# Altium schematic sheet ESIMA E-Meter_Radio.SchDoc: Esima Radio (zu CC2530EVM)
size A3; DrawnBy: Jürgen Merz; Address1: Wilhelm- Schickard- Strasse 10; Address2: 78052 Villingen Schwenningen; Address3: juergen.merz@hsg-imit.de; Address4: Tel. +49 7721 943 138; PhoneNumber: +49 7721 943 138; FaxNumber: +49 7721 943 140
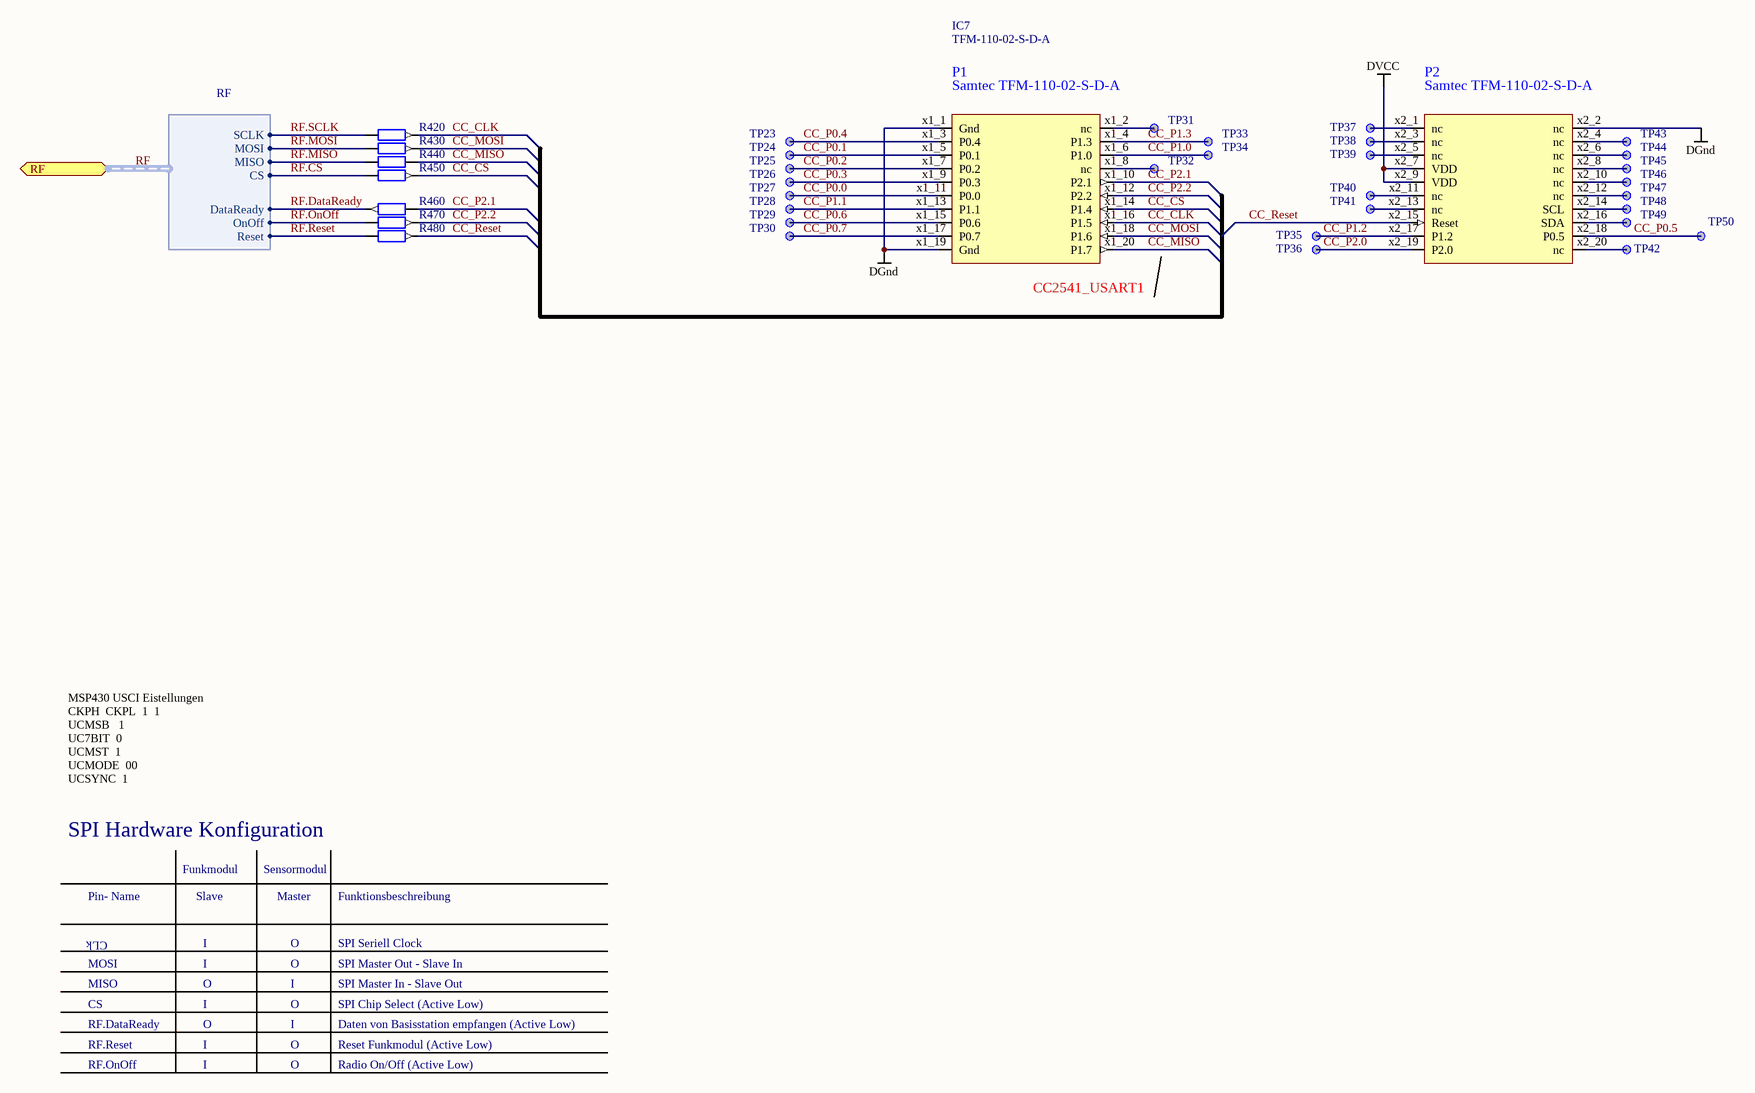
[diagram p0: ESIMA E-Meter_Radio.SchDoc]

## Parts
IC7  TFM-110-02-S-D-A  [CC2530EM-Board]
R42  0  [RESC1608N]
R43  0  [RESC1608N]
R44  0  [RESC1608N]
R45  0  [RESC1608N]
R46  0  [RESC1608N]
R47  0  [RESC1608N]
R48  0  [RESC1608N]
TP23  Testpoint 1mm  [Testpoint 1mm]  (value not drawn)  (no BOM)
TP24  Testpoint 1mm  [Testpoint 1mm]  (value not drawn)  (no BOM)
TP25  Testpoint 1mm  [Testpoint 1mm]  (value not drawn)  (no BOM)
TP26  Testpoint 1mm  [Testpoint 1mm]  (value not drawn)  (no BOM)
TP27  Testpoint 1mm  [Testpoint 1mm]  (value not drawn)  (no BOM)
TP28  Testpoint 1mm  [Testpoint 1mm]  (value not drawn)  (no BOM)
TP29  Testpoint 1mm  [Testpoint 1mm]  (value not drawn)  (no BOM)
TP30  Testpoint 1mm  [Testpoint 1mm]  (value not drawn)  (no BOM)
TP31  Testpoint 1mm  [Testpoint 1mm]  (value not drawn)  (no BOM)
TP32  Testpoint 1mm  [Testpoint 1mm]  (value not drawn)  (no BOM)
TP33  Testpoint 1mm  [Testpoint 1mm]  (value not drawn)  (no BOM)
TP34  Testpoint 1mm  [Testpoint 1mm]  (value not drawn)  (no BOM)
TP35  Testpoint 1mm  [Testpoint 1mm]  (value not drawn)  (no BOM)
TP36  Testpoint 1mm  [Testpoint 1mm]  (value not drawn)  (no BOM)
TP37  Testpoint 1mm  [Testpoint 1mm]  (value not drawn)  (no BOM)
TP38  Testpoint 1mm  [Testpoint 1mm]  (value not drawn)  (no BOM)
TP39  Testpoint 1mm  [Testpoint 1mm]  (value not drawn)  (no BOM)
TP40  Testpoint 1mm  [Testpoint 1mm]  (value not drawn)  (no BOM)
TP41  Testpoint 1mm  [Testpoint 1mm]  (value not drawn)  (no BOM)
TP42  Testpoint 1mm  [Testpoint 1mm]  (value not drawn)  (no BOM)
TP43  Testpoint 1mm  [Testpoint 1mm]  (value not drawn)  (no BOM)
TP44  Testpoint 1mm  [Testpoint 1mm]  (value not drawn)  (no BOM)
TP45  Testpoint 1mm  [Testpoint 1mm]  (value not drawn)  (no BOM)
TP46  Testpoint 1mm  [Testpoint 1mm]  (value not drawn)  (no BOM)
TP47  Testpoint 1mm  [Testpoint 1mm]  (value not drawn)  (no BOM)
TP48  Testpoint 1mm  [Testpoint 1mm]  (value not drawn)  (no BOM)
TP49  Testpoint 1mm  [Testpoint 1mm]  (value not drawn)  (no BOM)
TP50  Testpoint 1mm  [Testpoint 1mm]  (value not drawn)  (no BOM)

## Ports
RF (harness RF)

## Harnesses
RF: SCLK, MOSI, MISO, CS, DataReady, OnOff, Reset

## Nets
DGnd: IC7.x1_1(Gnd) IC7.x1_19(Gnd) IC7.x2_2(nc)
DVCC: IC7.x2_7(VDD) IC7.x2_9(VDD)
CC_CLK: IC7.x1_16(P1.5) R42.1
CC_CS: IC7.x1_14(P1.4) R45.1
CC_MISO: IC7.x1_20(P1.7) R44.1
CC_MOSI: IC7.x1_18(P1.6) R43.1
CC_P0.0: IC7.x1_11(P0.0) TP27.1
CC_P0.1: IC7.x1_5(P0.1) TP24.1
CC_P0.2: IC7.x1_7(P0.2) TP25.1
CC_P0.3: IC7.x1_9(P0.3) TP26.1
CC_P0.4: IC7.x1_3(P0.4) TP23.1
CC_P0.5: IC7.x2_18(P0.5) TP50.1
CC_P0.6: IC7.x1_15(P0.6) TP29.1
CC_P0.7: IC7.x1_17(P0.7) TP30.1
CC_P1.0: IC7.x1_6(P1.0) TP34.1
CC_P1.1: IC7.x1_13(P1.1) TP28.1
CC_P1.2: IC7.x2_17(P1.2) TP35.1
CC_P1.3: IC7.x1_4(P1.3) TP33.1
CC_P2.0: IC7.x2_19(P2.0) TP36.1
CC_P2.1: IC7.x1_10(P2.1) R46.1
CC_P2.2: IC7.x1_12(P2.2) R47.1
CC_Reset: IC7.x2_15(Reset) R48.1
RF.CS: R45.2 ; port RF.CS
RF.DataReady: R46.2 ; port RF.DataReady
RF.MISO: R44.2 ; port RF.MISO
RF.MOSI: R43.2 ; port RF.MOSI
RF.OnOff: R47.2 ; port RF.OnOff
RF.Reset: R48.2 ; port RF.Reset
RF.SCLK: R42.2 ; port RF.SCLK
NetIC7_x1_2: IC7.x1_2(nc) TP31.1
NetIC7_x1_8: IC7.x1_8(nc) TP32.1
NetIC7_x2_1: IC7.x2_1(nc) TP37.1
NetIC7_x2_3: IC7.x2_3(nc) TP38.1
NetIC7_x2_4: IC7.x2_4(nc) TP43.1
NetIC7_x2_5: IC7.x2_5(nc) TP39.1
NetIC7_x2_6: IC7.x2_6(nc) TP44.1
NetIC7_x2_8: IC7.x2_8(nc) TP45.1
NetIC7_x2_10: IC7.x2_10(nc) TP46.1
NetIC7_x2_11: IC7.x2_11(nc) TP40.1
NetIC7_x2_12: IC7.x2_12(nc) TP47.1
NetIC7_x2_13: IC7.x2_13(nc) TP41.1
NetIC7_x2_14: IC7.x2_14(SCL) TP48.1
NetIC7_x2_16: IC7.x2_16(SDA) TP49.1
NetIC7_x2_20: IC7.x2_20(nc) TP42.1

## Buses and harness runs
harness RF = port RF

## Notes on the sheet
- (near IC7) CC2541_USART1
- MSP430 USCI Eistellungen
  CKPH  CKPL 	1  1
  UCMSB 		1
  UC7BIT		0
  UCMST		1
  UCMODE		00
  UCSYNC		1
- SPI Hardware Konfiguration
- Pin- Name
- Funkmodul
- Slave
- Sensormodul
- Master
- Funktionsbeschreibung
- MOSI
- CLk
- I
- O
- SPI Seriell Clock
- SPI Master Out - Slave In
- MISO
- CS
- RF.DataReady
- RF.Reset
- SPI Chip Select (Active Low)
- Reset Funkmodul (Active Low)
- Daten von Basisstation empfangen (Active Low)
- SPI Master In - Slave Out
- RF.OnOff
- Radio On/Off (Active Low)
- Title
- Size:
- Date:
- A3
- Number:
- Time:
- Revision:
- Sheet
- of
- File:
- (in symbol CC2530EM) P1; P2; Samtec TFM-110-02-S-D-A

## Library data of the parts
IC7 = CC2530EM: Samtec Connecotor; Supplier 1: Farnell; Supplier Part Number 1: 2308453
R42-R48 = RESC1608 (R0603): Supplier 1: Farnell; Supplier Part Number 1: 2008343
TP23-TP50 = Tespoint 1mm